# Altium schematic sheet battery_current-meas.SchDoc: Battery Current Measurement
size A4; Date: 2015-09-21; Author: Piotr Kuligowski; DocumentNumber: 1; Revision: 1-0; SheetNumber: 1; SheetTotal: 14; Model: EM1
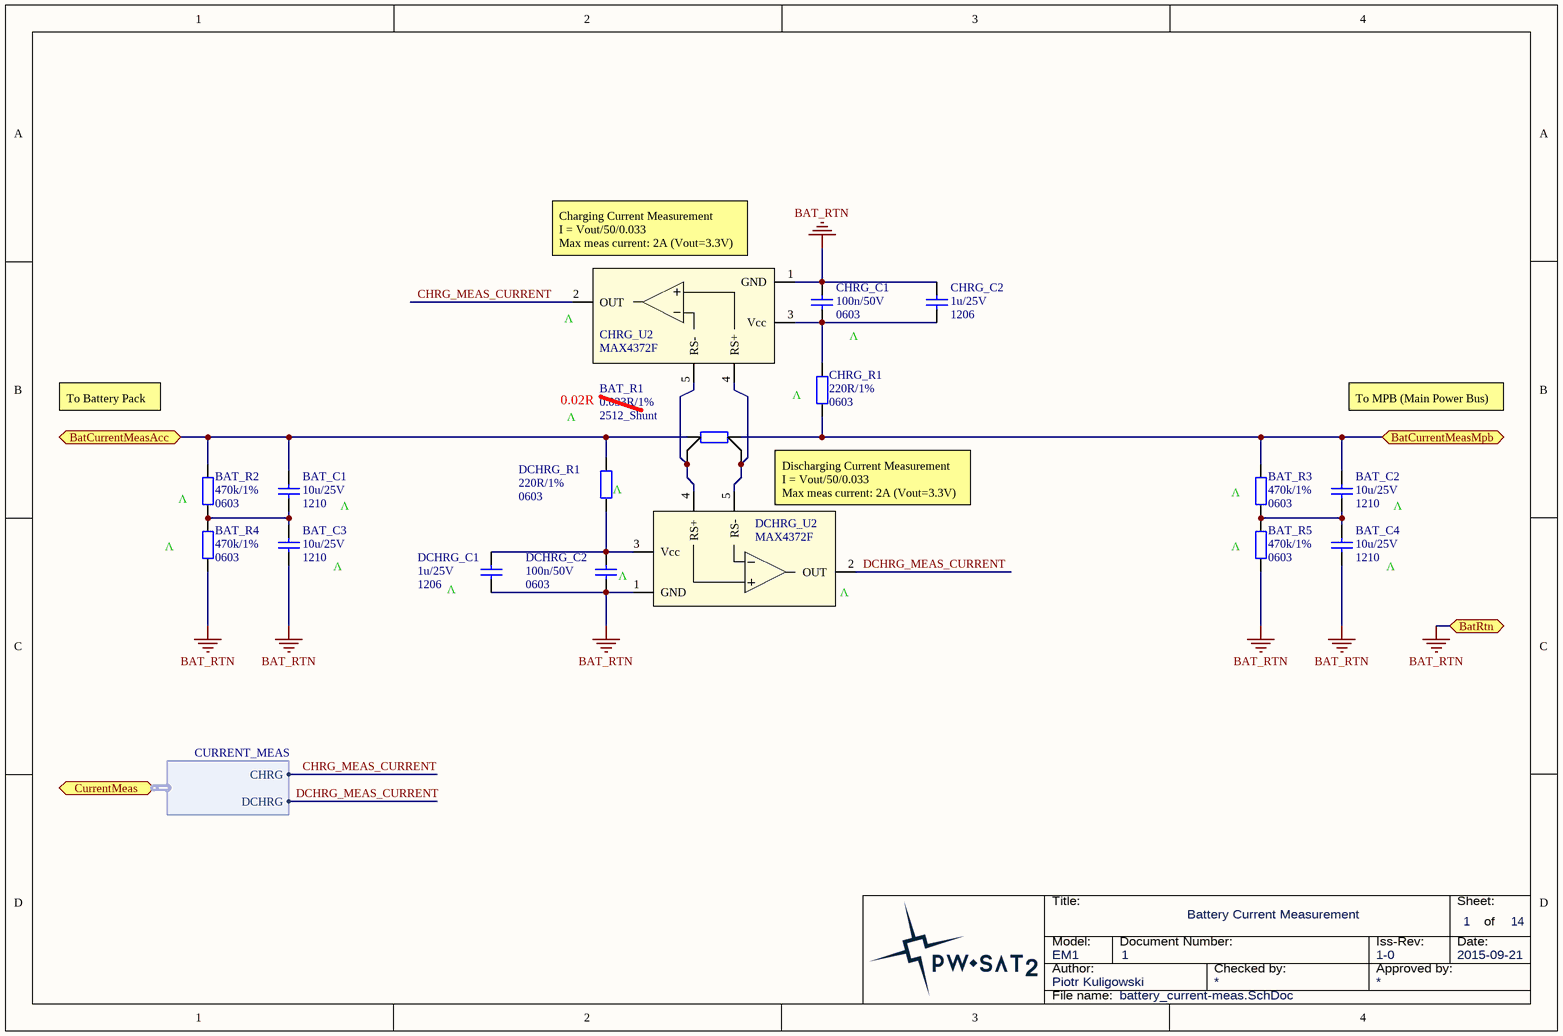
[diagram p0: battery_current-meas.SchDoc]

## Parts
BAT_C1  Package: 1210  [SMD_Capacitor_1210]  (hidden comment: 10u/25V)
BAT_C2  Package: 1210  [SMD_Capacitor_1210]  (hidden comment: 10u/25V)
BAT_C3  Package: 1210  [SMD_Capacitor_1210]  (hidden comment: 10u/25V)
BAT_C4  Package: 1210  [SMD_Capacitor_1210]  (hidden comment: 10u/25V)
BAT_R1  Package: 2512_Shunt  [SMD_Resistor-shunt_2512]  (hidden comment: 0.033R/1%)
BAT_R2  Package: 0603  [SMD_Resistor_0603]  (hidden comment: 470k/1%)
BAT_R3  Package: 0603  [SMD_Resistor_0603]  (hidden comment: 470k/1%)
BAT_R4  Package: 0603  [SMD_Resistor_0603]  (hidden comment: 470k/1%)
BAT_R5  Package: 0603  [SMD_Resistor_0603]  (hidden comment: 470k/1%)
CHRG_C1  Package: 0603  [SMD_Capacitor_0603]  (hidden comment: 100n/50V)
CHRG_C2  Package: 1206  [SMD_Capacitor_1206]  (hidden comment: 1u/25V)
CHRG_R1  Package: 0603  [SMD_Resistor_0603]  (hidden comment: 220R/1%)
CHRG_U2  MAX4372F  [SOT23-5]
DCHRG_C1  Package: 1206  [SMD_Capacitor_1206]  (hidden comment: 1u/25V)
DCHRG_C2  Package: 0603  [SMD_Capacitor_0603]  (hidden comment: 100n/50V)
DCHRG_R1  Package: 0603  [SMD_Resistor_0603]  (hidden comment: 220R/1%)
DCHRG_U2  MAX4372F  [SOT23-5]

## Ports
BatCurrentMeasAcc, BatCurrentMeasMpb, BatRtn, CurrentMeas (harness CURRENT_MEAS)

## Harnesses
CURRENT_MEAS: CHRG, DCHRG

## Nets
BAT_RTN: BAT_C3.2 BAT_C4.2 BAT_R4.2 BAT_R5.2 CHRG_C1.1 CHRG_C2.1 CHRG_U2.1(GND) DCHRG_C1.2 DCHRG_C2.2 DCHRG_U2.1(GND) ; port BatRtn
BatCurrentMeasAcc: BAT_C1.1 BAT_R1.1 BAT_R2.1 DCHRG_R1.1 ; port BatCurrentMeasAcc
BatCurrentMeasMpb: BAT_C2.1 BAT_R1.4 BAT_R3.1 CHRG_R1.1 ; port BatCurrentMeasMpb
CHRG_MEAS_CURRENT: CHRG_U2.2(OUT) ; port CurrentMeas.CHRG
DCHRG_MEAS_CURRENT: DCHRG_U2.2(OUT) ; port CurrentMeas.DCHRG
NetBAT_C1_2: BAT_C1.2 BAT_C3.1 BAT_R2.2 BAT_R4.1
NetBAT_C2_2: BAT_C2.2 BAT_C4.1 BAT_R3.2 BAT_R5.1
NetBAT_R1_2: BAT_R1.2 CHRG_U2.5(RS-) DCHRG_U2.4(RS+)
NetBAT_R1_3: BAT_R1.3 CHRG_U2.4(RS+) DCHRG_U2.5(RS-)
NetCHRG_C1_2: CHRG_C1.2 CHRG_C2.2 CHRG_R1.2 CHRG_U2.3(Vcc)
NetDCHRG_C1_1: DCHRG_C1.1 DCHRG_C2.1 DCHRG_R1.2 DCHRG_U2.3(Vcc)

## Notes on the sheet
- (near CHRG_U2) Charging Current Measurement
  I = Vout/50/0.033
  Max meas current: 2A (Vout=3.3V)
- (near CHRG_U2) V
- (near CHRG_R1) V
- V
- To Battery Pack
- (near CHRG_U2) 0.02R
- To MPB (Main Power Bus)
- (near BAT_R2) V
- (near DCHRG_R1) V
- (near DCHRG_U2) Discharging Current Measurement
  I = Vout/50/0.033
  Max meas current: 2A (Vout=3.3V)
- (near BAT_R3) V
- (near DCHRG_C1) V
- (near DCHRG_U2) V
- (near BAT_R5) V
- Title:
- Sheet:
- of
- Author:
- Model:
- Document Number:
- Checked by:
- Iss-Rev:
- Approved by:
- Date:
- File name:

## Library data of the parts
BAT_C1-BAT_C4 = Cer_GCJ32ER71E106KA12L: Ceramic Cap Murata Automotive 10u/25V X7R 1210; Manufacturer: Murata; ManufacturerPartNumber: GCJ32ER71E106KA12L; Value: 10u/25V
BAT_R1 = LR2512-R033FW: 33mR ,1%, 2W, shunt resistor, TE Connectivity.; ManufacturerPartNumber: LR2512-R033FW; Manufacturer: TE Connectivity; Power Rating: 2W; Value: 0.033R/1%
BAT_R2-BAT_R5 = CRCW0603470KFKxxxx: 470k/1% Vishay CRCW 0603 Resistor. 100mW, 100ppm, 75V.; Manufacturer: Vishay; ManufacturerPartNumber: CRCW0603470KFKxxxx; Value: 470k/1%
CHRG_C1 DCHRG_C2 = Cer_GCJ188R71H104KA12D: Ceramic Cap Murata Automotive 100n/50V X7R 0603; Manufacturer: Murata; ManufacturerPartNumber: GCJ188R71H104KA12D; Value: 100n/50V
CHRG_C2 DCHRG_C1 = Cer_C1206T105K3RALTU: Ceramic Cap Kemet COTS 1u/25V X7R 1206; ManufacturerPartNumber: C1206T105K3RALTU; Manufacturer: Kemet; Value: 1u/25V
CHRG_R1 DCHRG_R1 = CRCW0603220RFKxxxx: 220R/1% Vishay CRCW 0603 Resistor. 100mW, 100ppm, 75V.; ManufacturerPartNumber: CRCW0603220RFKxxxx; Manufacturer: Vishay; Value: 220R/1%
CHRG_U2 DCHRG_U2 = MAX4372: High-Side Current-Sense Amplifier with Voltage Output; Manufacturer: Maxim Integrated Products; Value: MAX4372F